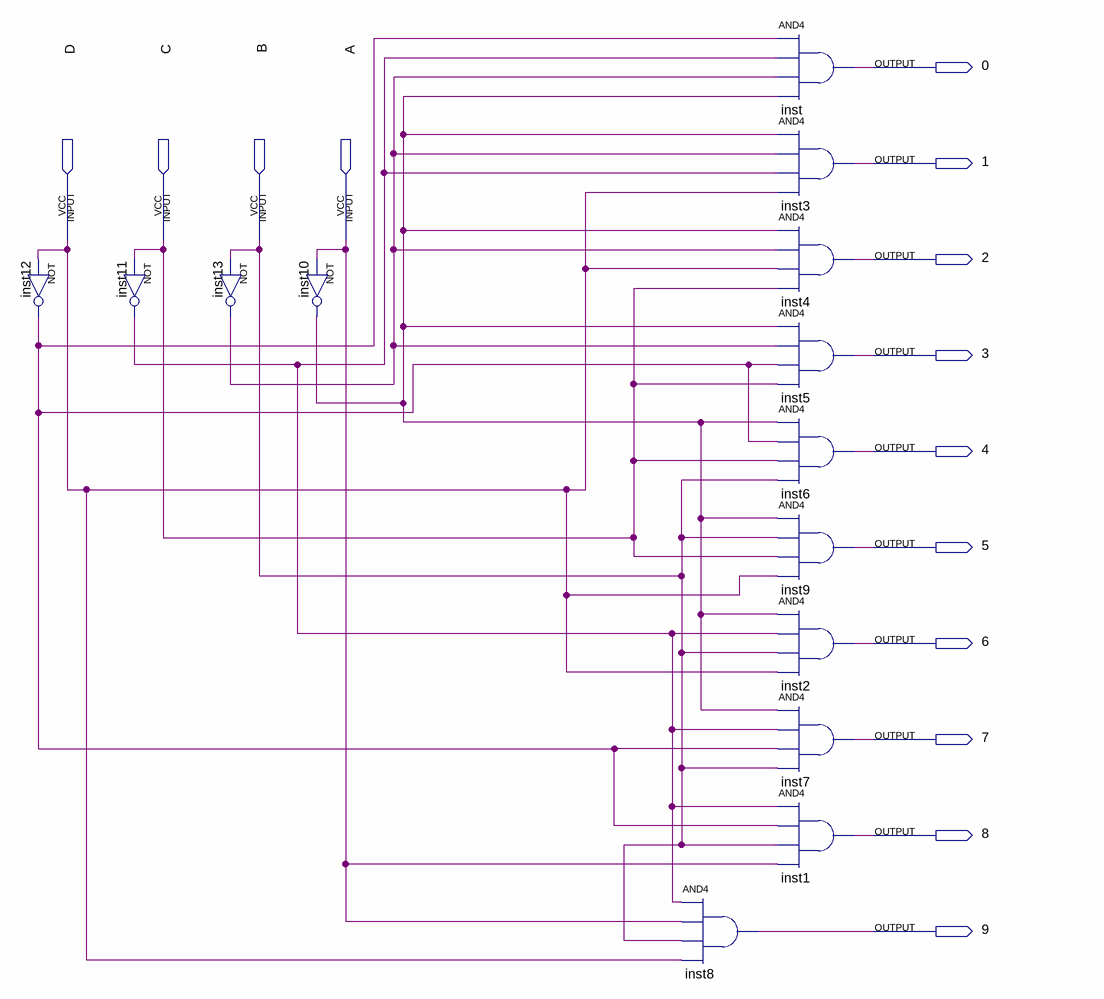
[diagram p0: schematic sheet]
// Quartus schematic EXP5decode.bdf as structural Verilog: 14 symbols, 14 pins
module EXP5decode (
  input  D,
  input  C,
  input  B,
  input  A,
  output \0 ,
  output \1 ,
  output \2 ,
  output \3 ,
  output \4 ,
  output \5 ,
  output \6 ,
  output \7 ,
  output \8 ,
  output \9 
);

  wire inst10_out, inst11_out, inst12_out, inst13_out;

  not inst12 (inst12_out, D);
  not inst11 (inst11_out, C);
  not inst13 (inst13_out, B);
  not inst10 (inst10_out, A);
  and inst8 (\9 , inst11_out, A, B, D);
  and inst (\0 , inst12_out, inst11_out, inst13_out, inst10_out);
  and inst3 (\1 , inst10_out, inst13_out, inst11_out, D);
  and inst4 (\2 , inst10_out, inst13_out, D, C);
  and inst5 (\3 , inst10_out, inst13_out, inst12_out, C);
  and inst6 (\4 , inst10_out, inst12_out, C, B);
  and inst9 (\5 , inst10_out, B, C, D);
  and inst2 (\6 , inst10_out, inst11_out, B, D);
  and inst7 (\7 , inst10_out, inst11_out, inst12_out, B);
  and inst1 (\8 , inst11_out, inst12_out, B, A);
endmodule
